# Altium schematic sheet Type-C接口及程序下载.SchDoc
size A4
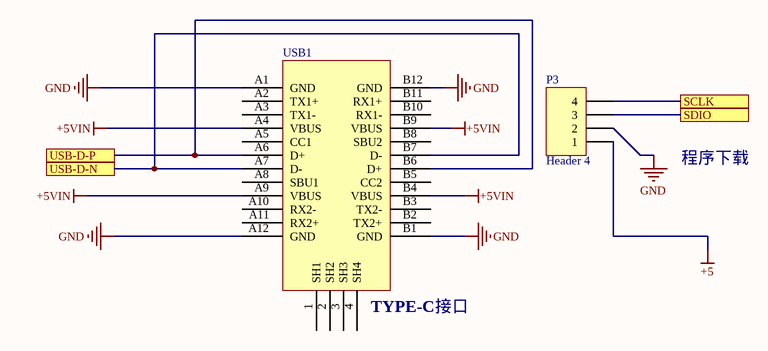
[diagram p0: Type-C接口及程序下载.SchDoc]

## Parts
P3  Header 4  [HDR1X4]
USB1  TYPE-C  [TYPE-C]  (value not drawn)

## Ports
SCLK, SDIO, USB-D-N, USB-D-P

## Nets
+5: P3.1
+5VIN: USB1.A4(VBUS) USB1.A9(VBUS) USB1.B4(VBUS) USB1.B9(VBUS)
GND: P3.2 USB1.A1(GND) USB1.A12(GND) USB1.B1(GND) USB1.B12(GND)
SCLK: P3.4 ; port SCLK
SDIO: P3.3 ; port SDIO
USB-D-N: USB1.A7(D-) USB1.B7(D-) ; port USB-D-N
USB-D-P: USB1.A6(D+) USB1.B6(D+) ; port USB-D-P

Not connected (* = marked no-connect by the designer): USB1 1(SH1) 2(SH2) 3(SH3) 4(SH4) A2(TX1+) A3(TX1-) A5(CC1) A8(SBU1) A10(RX2-) A11(RX2+) B2(TX2+) B3(TX2-) B5(CC2) B8(SBU2) B10(RX1-) B11(RX1+)

## Notes on the sheet
- 程序下载
- (near USB1) TYPE-C接口

## Library data of the parts
P3 = Header 4: Header, 4-Pin; LatestRevisionDate: 17-Jul-2002; LatestRevisionNote: Re-released for DXP Platform.; Publisher: Altium Limited